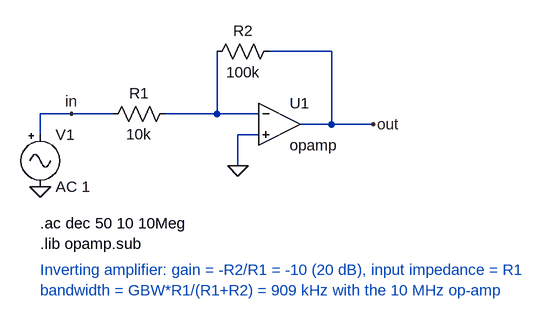
[diagram p0: schematic inverting_amplifier.asc]
inverting_amplifier.asc, the LTspice schematic file:
Version 4
SHEET 1 880 680
WIRE 304 48 304 144
WIRE 480 48 384 48
WIRE 480 160 480 48
WIRE 32 144 32 176
WIRE 144 144 32 144
WIRE 368 144 224 144
WIRE 336 176 368 176
WIRE 336 224 336 176
WIRE 544 160 432 160
FLAG 32 256 0
FLAG 336 224 0
FLAG 80 144 in
FLAG 544 160 out
SYMBOL Misc\signal 32 160 R0
SYMATTR InstName V1
SYMATTR Value AC 1
SYMBOL res 240 128 R90
WINDOW 0 0 56 VBottom 2
WINDOW 3 32 56 VTop 2
SYMATTR InstName R1
SYMATTR Value 10k
SYMBOL res 400 32 R90
WINDOW 0 0 56 VBottom 2
WINDOW 3 32 56 VTop 2
SYMATTR InstName R2
SYMATTR Value 100k
SYMBOL OpAmps\opamp 400 96 R0
SYMATTR InstName U1
TEXT 32 312 Left 2 !.ac dec 50 10 10Meg
TEXT 32 344 Left 2 !.lib opamp.sub
TEXT 32 384 Left 2 ;Inverting amplifier: gain = -R2/R1 = -10 (20 dB), input impedance = R1\nbandwidth = GBW*R1/(R1+R2) = 909 kHz with the 10 MHz op-amp

The netlist it stands for:
* inverting_amplifier.asc
V1 in 0 AC 1
R1 N001 in 10k
R2 out N001 100k
XU1 N001 0 out opamp Aol=100K GBW=10Meg  ; pins invin noninvin out
.ac dec 50 10 10Meg
.lib opamp.sub
* Inverting amplifier: gain = -R2/R1 = -10 (20 dB), input impedance = R1
* bandwidth = GBW*R1/(R1+R2) = 909 kHz with the 10 MHz op-amp
.backanno
.end